# EAGLE design d150_in8-2_rev_a (EAGLE 6.1)
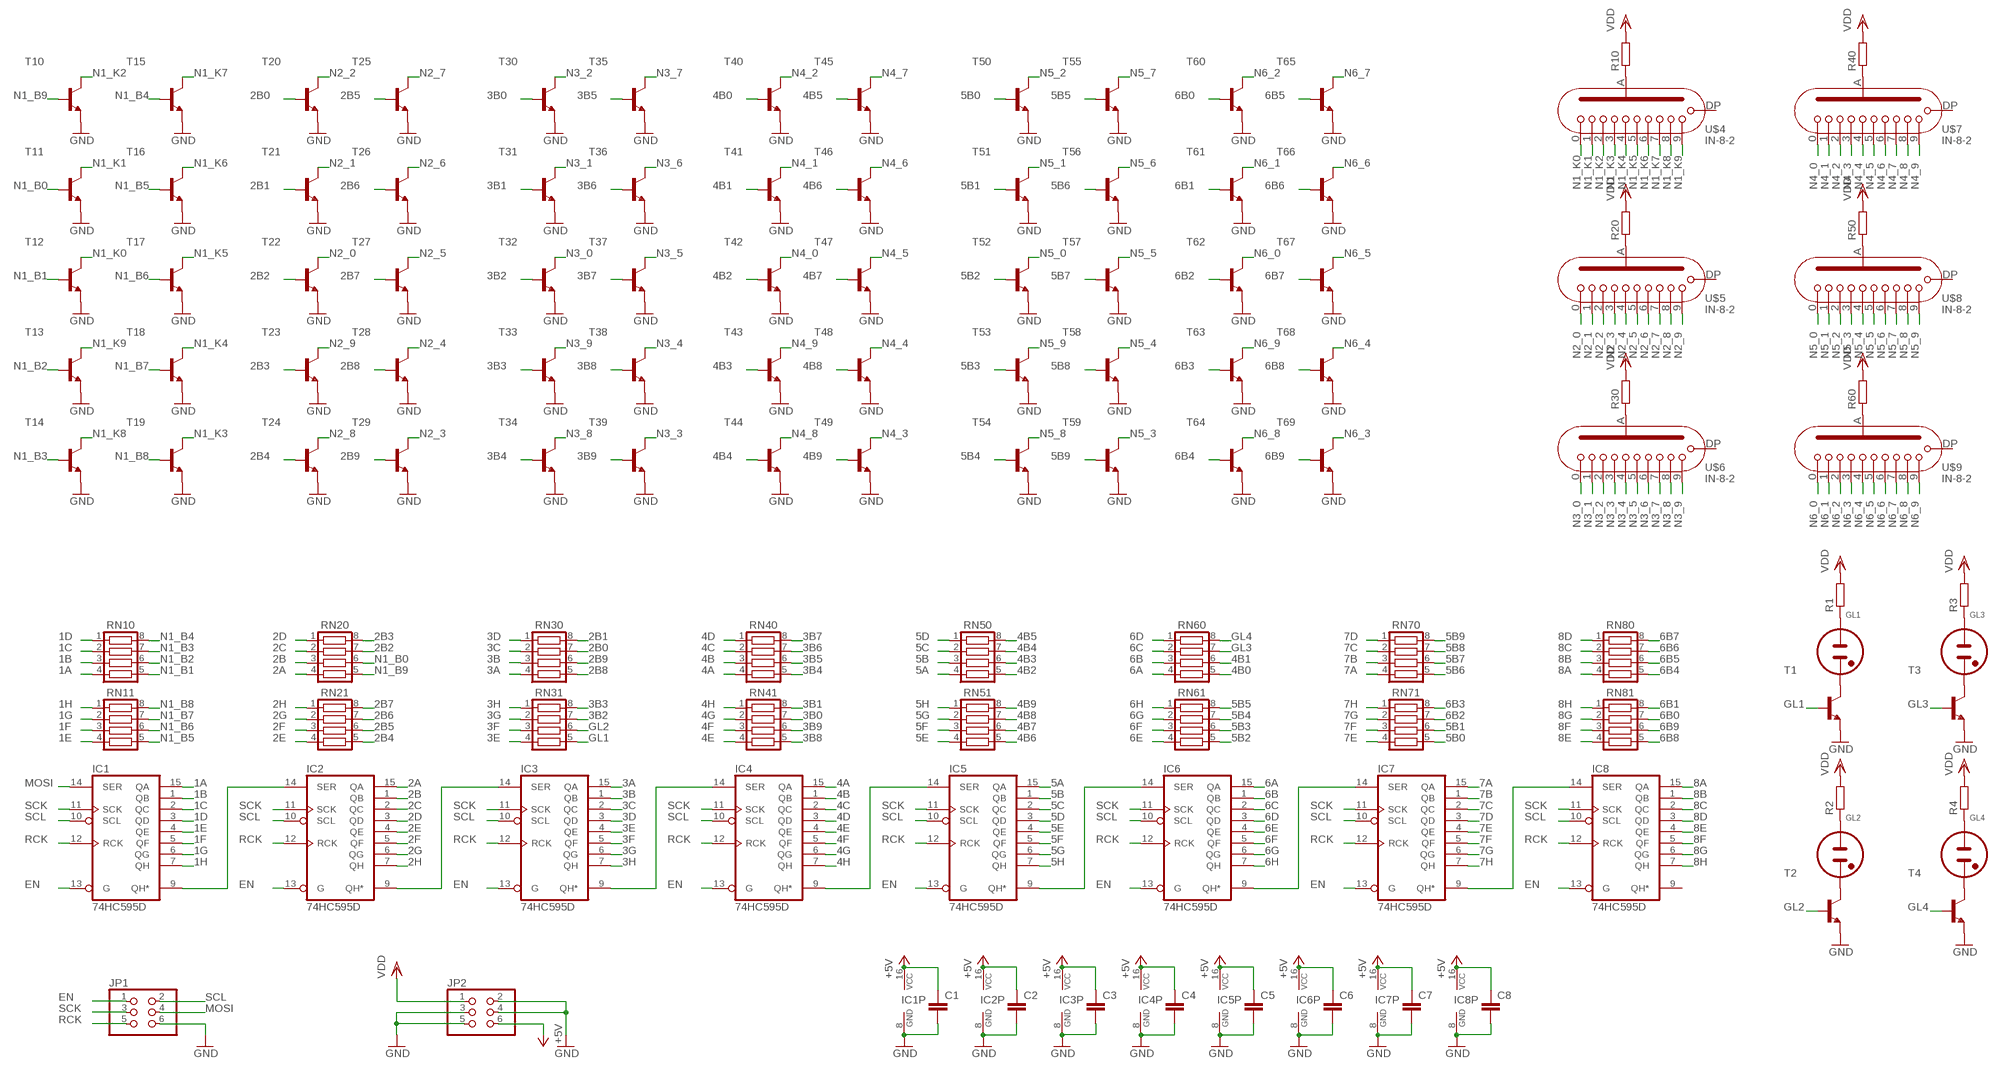
[diagram p0: schematic, sheet 1]

## Parts
C1  C-EUC0603  [C0603]
C2  C-EUC0603  [C0603]
C3  C-EUC0603  [C0603]
C4  C-EUC0603  [C0603]
C5  C-EUC0603  [C0603]
C6  C-EUC0603  [C0603]
C7  C-EUC0603  [C0603]
C8  C-EUC0603  [C0603]
GL1  NE2-NEON-BULB-DRILL  [NE2-NEON-BULB-DRILL]
GL2  NE2-NEON-BULB-DRILL  [NE2-NEON-BULB-DRILL]
GL3  NE2-NEON-BULB-DRILL  [NE2-NEON-BULB-DRILL]
GL4  NE2-NEON-BULB-DRILL  [NE2-NEON-BULB-DRILL]
IC1  74HC595D  [SO16]
IC2  74HC595D  [SO16]
IC3  74HC595D  [SO16]
IC4  74HC595D  [SO16]
IC5  74HC595D  [SO16]
IC6  74HC595D  [SO16]
IC7  74HC595D  [SO16]
IC8  74HC595D  [SO16]
JP1  PINHD-2X3_2.54-SMD  [2X03SMD]
JP2  PINHD-2X3_2.54-SMD  [2X03SMD]
R1  R-EU_R0603  [R0603]
R2  R-EU_R0603  [R0603]
R3  R-EU_R0603  [R0603]
R4  R-EU_R0603  [R0603]
R10  R-EU_R0603  [R0603]
R20  R-EU_R0603  [R0603]
R30  R-EU_R0603  [R0603]
R40  R-EU_R0603  [R0603]
R50  R-EU_R0603  [R0603]
R60  R-EU_R0603  [R0603]
RN10  CTS742C083  [CTS742C083]
RN11  CTS742C083  [CTS742C083]
RN20  CTS742C083  [CTS742C083]
RN21  CTS742C083  [CTS742C083]
RN30  CTS742C083  [CTS742C083]
RN31  CTS742C083  [CTS742C083]
RN40  CTS742C083  [CTS742C083]
RN41  CTS742C083  [CTS742C083]
RN50  CTS742C083  [CTS742C083]
RN51  CTS742C083  [CTS742C083]
RN60  CTS742C083  [CTS742C083]
RN61  CTS742C083  [CTS742C083]
RN70  CTS742C083  [CTS742C083]
RN71  CTS742C083  [CTS742C083]
RN80  CTS742C083  [CTS742C083]
RN81  CTS742C083  [CTS742C083]
T1  SMBTA42  [SOT23]
T2  SMBTA42  [SOT23]
T3  SMBTA42  [SOT23]
T4  SMBTA42  [SOT23]
T10  SMBTA42  [SOT23]
T11  SMBTA42  [SOT23]
T12  SMBTA42  [SOT23]
T13  SMBTA42  [SOT23]
T14  SMBTA42  [SOT23]
T15  SMBTA42  [SOT23]
T16  SMBTA42  [SOT23]
T17  SMBTA42  [SOT23]
T18  SMBTA42  [SOT23]
T19  SMBTA42  [SOT23]
T20  SMBTA42  [SOT23]
T21  SMBTA42  [SOT23]
T22  SMBTA42  [SOT23]
T23  SMBTA42  [SOT23]
T24  SMBTA42  [SOT23]
T25  SMBTA42  [SOT23]
T26  SMBTA42  [SOT23]
T27  SMBTA42  [SOT23]
T28  SMBTA42  [SOT23]
T29  SMBTA42  [SOT23]
T30  SMBTA42  [SOT23]
T31  SMBTA42  [SOT23]
T32  SMBTA42  [SOT23]
T33  SMBTA42  [SOT23]
T34  SMBTA42  [SOT23]
T35  SMBTA42  [SOT23]
T36  SMBTA42  [SOT23]
T37  SMBTA42  [SOT23]
T38  SMBTA42  [SOT23]
T39  SMBTA42  [SOT23]
T40  SMBTA42  [SOT23]
T41  SMBTA42  [SOT23]
T42  SMBTA42  [SOT23]
T43  SMBTA42  [SOT23]
T44  SMBTA42  [SOT23]
T45  SMBTA42  [SOT23]
T46  SMBTA42  [SOT23]
T47  SMBTA42  [SOT23]
T48  SMBTA42  [SOT23]
T49  SMBTA42  [SOT23]
T50  SMBTA42  [SOT23]
T51  SMBTA42  [SOT23]
T52  SMBTA42  [SOT23]
T53  SMBTA42  [SOT23]
T54  SMBTA42  [SOT23]
T55  SMBTA42  [SOT23]
T56  SMBTA42  [SOT23]
T57  SMBTA42  [SOT23]
T58  SMBTA42  [SOT23]
T59  SMBTA42  [SOT23]
T60  SMBTA42  [SOT23]
T61  SMBTA42  [SOT23]
T62  SMBTA42  [SOT23]
T63  SMBTA42  [SOT23]
T64  SMBTA42  [SOT23]
T65  SMBTA42  [SOT23]
T66  SMBTA42  [SOT23]
T67  SMBTA42  [SOT23]
T68  SMBTA42  [SOT23]
T69  SMBTA42  [SOT23]
U$4  IN-8-2  [IN-8-2]
U$5  IN-8-2  [IN-8-2]
U$6  IN-8-2  [IN-8-2]
U$7  IN-8-2  [IN-8-2]
U$8  IN-8-2  [IN-8-2]
U$9  IN-8-2  [IN-8-2]

## Nets
1A: IC1.15(QA) RN10.4
1B: IC1.1(QB) RN10.3
1C: IC1.2(QC) RN10.2
1D: IC1.3(QD) RN10.1
1E: IC1.4(QE) RN11.4
1F: IC1.5(QF) RN11.3
1G: IC1.6(QG) RN11.2
1H: IC1.7(QH) RN11.1
2A: IC2.15(QA) RN20.4
2B: IC2.1(QB) RN20.3
2B0: RN30.7 T20.1(B)
2B1: RN30.8 T21.1(B)
2B2: RN20.7 T22.1(B)
2B3: RN20.8 T23.1(B)
2B4: RN21.5 T24.1(B)
2B5: RN21.6 T25.1(B)
2B6: RN21.7 T26.1(B)
2B7: RN21.8 T27.1(B)
2B8: RN30.5 T28.1(B)
2B9: RN30.6 T29.1(B)
2C: IC2.2(QC) RN20.2
2D: IC2.3(QD) RN20.1
2E: IC2.4(QE) RN21.4
2F: IC2.5(QF) RN21.3
2G: IC2.6(QG) RN21.2
2H: IC2.7(QH) RN21.1
3A: IC3.15(QA) RN30.4
3B: IC3.1(QB) RN30.3
3B0: RN41.7 T30.1(B)
3B1: RN41.8 T31.1(B)
3B2: RN31.7 T32.1(B)
3B3: RN31.8 T33.1(B)
3B4: RN40.5 T34.1(B)
3B5: RN40.6 T35.1(B)
3B6: RN40.7 T36.1(B)
3B7: RN40.8 T37.1(B)
3B8: RN41.5 T38.1(B)
3B9: RN41.6 T39.1(B)
3C: IC3.2(QC) RN30.2
3D: IC3.3(QD) RN30.1
3E: IC3.4(QE) RN31.4
3F: IC3.5(QF) RN31.3
3G: IC3.6(QG) RN31.2
3H: IC3.7(QH) RN31.1
4A: IC4.15(QA) RN40.4
4B: IC4.1(QB) RN40.3
4B0: RN60.5 T40.1(B)
4B1: RN60.6 T41.1(B)
4B2: RN50.5 T42.1(B)
4B3: RN50.6 T43.1(B)
4B4: RN50.7 T44.1(B)
4B5: RN50.8 T45.1(B)
4B6: RN51.5 T46.1(B)
4B7: RN51.6 T47.1(B)
4B8: RN51.7 T48.1(B)
4B9: RN51.8 T49.1(B)
4C: IC4.2(QC) RN40.2
4D: IC4.3(QD) RN40.1
4E: IC4.4(QE) RN41.4
4F: IC4.5(QF) RN41.3
4G: IC4.6(QG) RN41.2
4H: IC4.7(QH) RN41.1
5A: IC5.15(QA) RN50.4
5B: IC5.1(QB) RN50.3
5B0: RN71.5 T50.1(B)
5B1: RN71.6 T51.1(B)
5B2: RN61.5 T52.1(B)
5B3: RN61.6 T53.1(B)
5B4: RN61.7 T54.1(B)
5B5: RN61.8 T55.1(B)
5B6: RN70.5 T56.1(B)
5B7: RN70.6 T57.1(B)
5B8: RN70.7 T58.1(B)
5B9: RN70.8 T59.1(B)
5C: IC5.2(QC) RN50.2
5D: IC5.3(QD) RN50.1
5E: IC5.4(QE) RN51.4
5F: IC5.5(QF) RN51.3
5G: IC5.6(QG) RN51.2
5H: IC5.7(QH) RN51.1
6A: IC6.15(QA) RN60.4
6B: IC6.1(QB) RN60.3
6B0: RN81.7 T60.1(B)
6B1: RN81.8 T61.1(B)
6B2: RN71.7 T62.1(B)
6B3: RN71.8 T63.1(B)
6B4: RN80.5 T64.1(B)
6B5: RN80.6 T65.1(B)
6B6: RN80.7 T66.1(B)
6B7: RN80.8 T67.1(B)
6B8: RN81.5 T68.1(B)
6B9: RN81.6 T69.1(B)
6C: IC6.2(QC) RN60.2
6D: IC6.3(QD) RN60.1
6E: IC6.4(QE) RN61.4
6F: IC6.5(QF) RN61.3
6G: IC6.6(QG) RN61.2
6H: IC6.7(QH) RN61.1
7A: IC7.15(QA) RN70.4
7B: IC7.1(QB) RN70.3
7C: IC7.2(QC) RN70.2
7D: IC7.3(QD) RN70.1
7E: IC7.4(QE) RN71.4
7F: IC7.5(QF) RN71.3
7G: IC7.6(QG) RN71.2
7H: IC7.7(QH) RN71.1
8A: IC8.15(QA) RN80.4
8B: IC8.1(QB) RN80.3
8C: IC8.2(QC) RN80.2
8D: IC8.3(QD) RN80.1
8E: IC8.4(QE) RN81.4
8F: IC8.5(QF) RN81.3
8G: IC8.6(QG) RN81.2
8H: IC8.7(QH) RN81.1
+5V: C1.1 C2.1 C3.1 C4.1 C5.1 C6.1 C7.1 C8.1 IC1.16(VCC) IC2.16(VCC) IC3.16(VCC) IC4.16(VCC) IC5.16(VCC) IC6.16(VCC) IC7.16(VCC) IC8.16(VCC) JP2.6
EN: IC1.13(G) IC2.13(G) IC3.13(G) IC4.13(G) IC5.13(G) IC6.13(G) IC7.13(G) IC8.13(G) JP1.1
GL1: RN31.5 T1.1(B)
GL2: RN31.6 T2.1(B)
GL3: RN60.7 T3.1(B)
GL4: RN60.8 T4.1(B)
GND: C1.2 C2.2 C3.2 C4.2 C5.2 C6.2 C7.2 C8.2 IC1.8(GND) IC2.8(GND) IC3.8(GND) IC4.8(GND) IC5.8(GND) IC6.8(GND) IC7.8(GND) IC8.8(GND) JP1.6 JP2.2 JP2.3 JP2.4 JP2.5 T1.2(E) T2.2(E) T3.2(E) T4.2(E) T10.2(E) T11.2(E) T12.2(E) T13.2(E) T14.2(E) T15.2(E) T16.2(E) T17.2(E) T18.2(E) T19.2(E) T20.2(E) T21.2(E) T22.2(E) T23.2(E) T24.2(E) T25.2(E) T26.2(E) T27.2(E) T28.2(E) T29.2(E) T30.2(E) T31.2(E) T32.2(E) T33.2(E) T34.2(E) T35.2(E) T36.2(E) T37.2(E) T38.2(E) T39.2(E) T40.2(E) T41.2(E) T42.2(E) T43.2(E) T44.2(E) T45.2(E) T46.2(E) T47.2(E) T48.2(E) T49.2(E) T50.2(E) T51.2(E) T52.2(E) T53.2(E) T54.2(E) T55.2(E) T56.2(E) T57.2(E) T58.2(E) T59.2(E) T60.2(E) T61.2(E) T62.2(E) T63.2(E) T64.2(E) T65.2(E) T66.2(E) T67.2(E) T68.2(E) T69.2(E)
MOSI: IC1.14(SER) JP1.4
N1_B0: RN20.6 T11.1(B)
N1_B1: RN10.5 T12.1(B)
N1_B2: RN10.6 T13.1(B)
N1_B3: RN10.7 T14.1(B)
N1_B4: RN10.8 T15.1(B)
N1_B5: RN11.5 T16.1(B)
N1_B6: RN11.6 T17.1(B)
N1_B7: RN11.7 T18.1(B)
N1_B8: RN11.8 T19.1(B)
N1_B9: RN20.5 T10.1(B)
N1_K0: T12.3(C) U$4.0
N1_K1: T11.3(C) U$4.1
N1_K2: T10.3(C) U$4.2
N1_K3: T19.3(C) U$4.3
N1_K4: T18.3(C) U$4.4
N1_K5: T17.3(C) U$4.5
N1_K6: T16.3(C) U$4.6
N1_K7: T15.3(C) U$4.7
N1_K8: T14.3(C) U$4.8
N1_K9: T13.3(C) U$4.9
N2_0: T22.3(C) U$5.0
N2_1: T21.3(C) U$5.1
N2_2: T20.3(C) U$5.2
N2_3: T29.3(C) U$5.3
N2_4: T28.3(C) U$5.4
N2_5: T27.3(C) U$5.5
N2_6: T26.3(C) U$5.6
N2_7: T25.3(C) U$5.7
N2_8: T24.3(C) U$5.8
N2_9: T23.3(C) U$5.9
N3_0: T32.3(C) U$6.0
N3_1: T31.3(C) U$6.1
N3_2: T30.3(C) U$6.2
N3_3: T39.3(C) U$6.3
N3_4: T38.3(C) U$6.4
N3_5: T37.3(C) U$6.5
N3_6: T36.3(C) U$6.6
N3_7: T35.3(C) U$6.7
N3_8: T34.3(C) U$6.8
N3_9: T33.3(C) U$6.9
N4_0: T42.3(C) U$7.0
N4_1: T41.3(C) U$7.1
N4_2: T40.3(C) U$7.2
N4_3: T49.3(C) U$7.3
N4_4: T48.3(C) U$7.4
N4_5: T47.3(C) U$7.5
N4_6: T46.3(C) U$7.6
N4_7: T45.3(C) U$7.7
N4_8: T44.3(C) U$7.8
N4_9: T43.3(C) U$7.9
N5_0: T52.3(C) U$8.0
N5_1: T51.3(C) U$8.1
N5_2: T50.3(C) U$8.2
N5_3: T59.3(C) U$8.3
N5_4: T58.3(C) U$8.4
N5_5: T57.3(C) U$8.5
N5_6: T56.3(C) U$8.6
N5_7: T55.3(C) U$8.7
N5_8: T54.3(C) U$8.8
N5_9: T53.3(C) U$8.9
N6_0: T62.3(C) U$9.0
N6_1: T61.3(C) U$9.1
N6_2: T60.3(C) U$9.2
N6_3: T69.3(C) U$9.3
N6_4: T68.3(C) U$9.4
N6_5: T67.3(C) U$9.5
N6_6: T66.3(C) U$9.6
N6_7: T65.3(C) U$9.7
N6_8: T64.3(C) U$9.8
N6_9: T63.3(C) U$9.9
N$1: GL2.1(A) R2.1
N$2: GL3.1(A) R3.1
N$3: GL4.1(A) R4.1
N$4: R10.1 U$4.A(A1)
N$5: GL2.2(A1) T2.3(C)
N$6: GL1.2(A1) T1.3(C)
N$7: GL4.2(A1) T4.3(C)
N$8: GL3.2(A1) T3.3(C)
N$9: R20.1 U$5.A(A1)
N$10: IC1.9(QH*) IC2.14(SER)
N$11: IC2.9(QH*) IC3.14(SER)
N$12: IC3.9(QH*) IC4.14(SER)
N$13: R30.1 U$6.A(A1)
N$14: R40.1 U$7.A(A1)
N$15: R50.1 U$8.A(A1)
N$16: IC4.9(QH*) IC5.14(SER)
N$17: R60.1 U$9.A(A1)
N$18: IC5.9(QH*) IC6.14(SER)
N$19: IC6.9(QH*) IC7.14(SER)
N$20: IC7.9(QH*) IC8.14(SER)
N$21: GL1.1(A) R1.1
RCK: IC1.12(RCK) IC2.12(RCK) IC3.12(RCK) IC4.12(RCK) IC5.12(RCK) IC6.12(RCK) IC7.12(RCK) IC8.12(RCK) JP1.5
SCK: IC1.11(SCK) IC2.11(SCK) IC3.11(SCK) IC4.11(SCK) IC5.11(SCK) IC6.11(SCK) IC7.11(SCK) IC8.11(SCK) JP1.3
SCL: IC1.10(SCL) IC2.10(SCL) IC3.10(SCL) IC4.10(SCL) IC5.10(SCL) IC6.10(SCL) IC7.10(SCL) IC8.10(SCL) JP1.2
VDD: JP2.1 R1.2 R2.2 R3.2 R4.2 R10.2 R20.2 R30.2 R40.2 R50.2 R60.2
Unconnected: IC8.9(QH*) U$4..(DP) U$5..(DP) U$6..(DP) U$7..(DP) U$8..(DP) U$9..(DP)

## Library data of the parts
C1-C8 = rcl:C-EU: CAPACITOR, European symbol
GL1-GL4 = nixie_tube:NE2-NEON-BULB: Neon indicator (wire connection)
IC1-IC8 = 74xx-eu:74*595: 8-bit SHIFT REGISTER, output latch
JP1 JP2 = con-pinhead:PINHD-2X3: PIN HEADER
R1-R4 R10 R20 R30 R40 R50 R60 = rcl:R-EU_: RESISTOR, European symbol
RN10 RN11 RN20 RN21 RN30 RN31 RN40 RN41 RN50 RN51 RN60 RN61 RN70 RN71 RN80 RN81 = resistor-net:CTS742C083: Chip Resistor Array 4 Single Resistor Source: http://www.ctscorp.com/components/Datasheets/CTSChipArrayDs.pdf; OC_FARNELL: unknown; OC_NEWARK: unknown
T1-T4 T10-T69 = transistor-hv:SMBTA42
U$4-U$9 = nixietubes-russian:IN-8-2

## Board
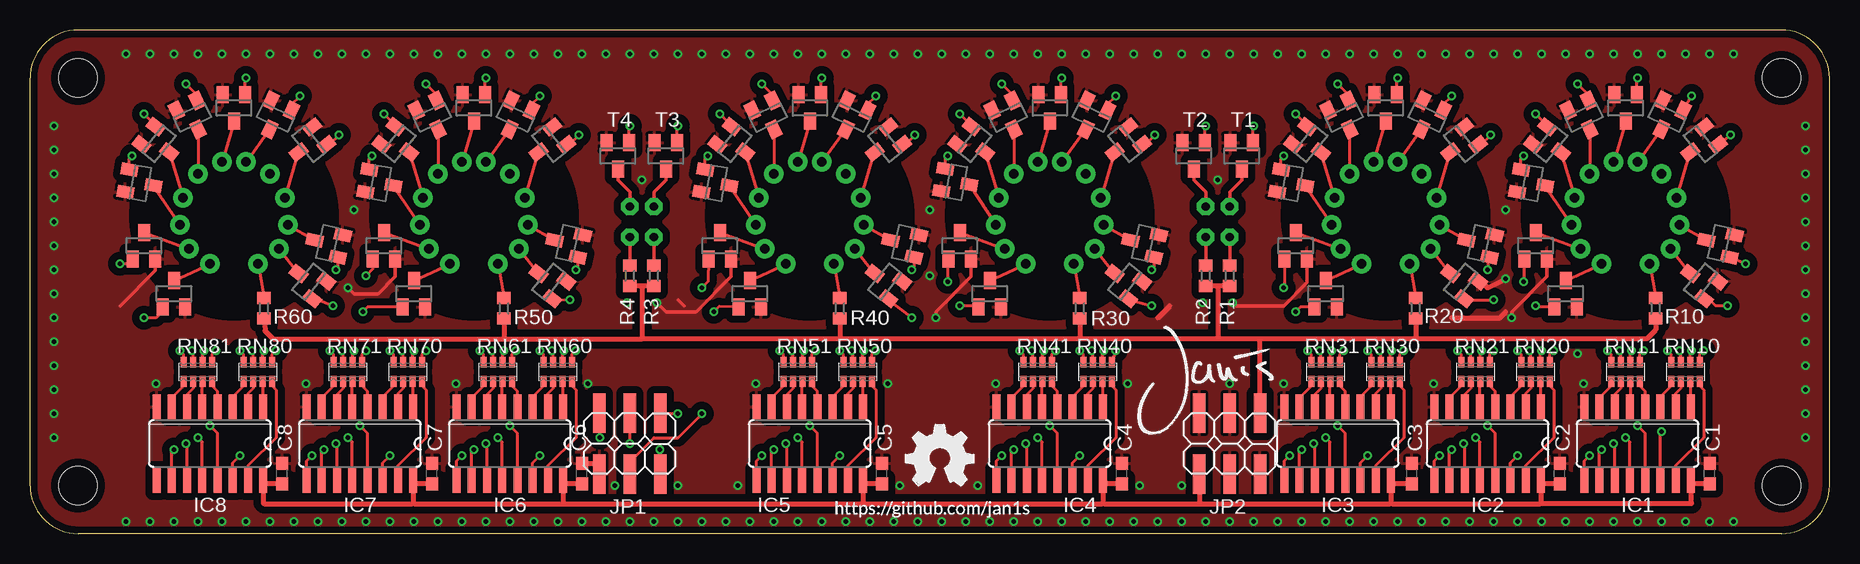
[diagram p1: board, top side]
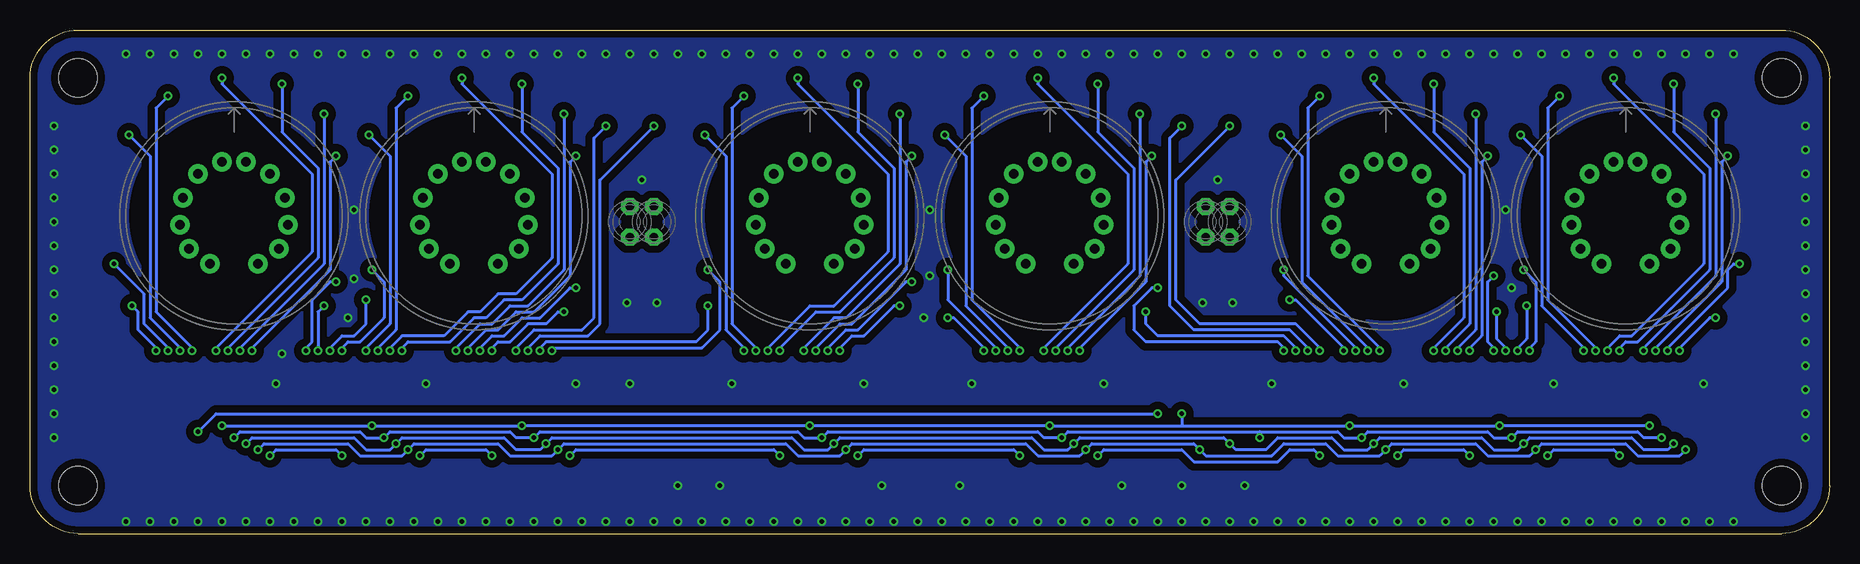
[diagram p2: board, bottom side, seen from below]

Size 150 x 42 mm. Coordinates in mm from the lower left corner, seen from the top.
Outline: 146,0 4,0 arc-90 0,4 0,38 arc-90 4,42 146,42 arc-90 150,38 150,4 arc-90 146,0
Copper layers (1*16): Top 0.035mm / dielectric 1.5mm / Bottom 0.035mm
Design rules: minimum track width 6mil, minimum drill 12mil, track to track 6mil, track to pad 6mil, pad to pad 6mil, via to via 6mil, smd to smd 0mil, copper to edge 10mil, drill to drill 10mil, minimum pad ring 3mil, minimum via ring 6mil, stop-mask expansion 2mil, vias tented up to drill 100mil, thermal gap 10mil
Holes 3.2 mm at 146,4 146,38 4,38 4,4
tRestrict: area 125,18.5 to 141,34.5; area 105,18.5 to 121,34.5; area 77,18.5 to 93,34.5; area 57,18.5 to 73,34.5; area 29,18.5 to 45,34.5; area 9,18.5 to 25,34.5
bRestrict: area 125,18.5 to 141,34.5; area 105,18.5 to 121,34.5; area 77,18.5 to 93,34.5; area 57,18.5 to 73,34.5; area 29,18.5 to 45,34.5; area 9,18.5 to 25,34.5

### Footprints (pad centres in the part's own frame; a part is rotated, then mirrored left to right if it is on the bottom)
C0603 = smd 1.1 x 1: 1 -0.85,0; 2 0.85,0
NE2-NEON-BULB-DRILL = drill 0.7 pad 1.422 octagon: 1 0,1.27; 2 0,-1.27
SO16 = smd 0.66 x 2.032: 1 -4.445,-3.073; 2 -3.175,-3.073; 3 -1.905,-3.073; 4 -0.635,-3.073; 5 0.635,-3.073; 6 1.905,-3.073; 7 3.175,-3.073; 8 4.445,-3.073; 9 4.445,3.073; 10 3.175,3.073; 11 1.905,3.073; 12 0.635,3.073; 13 -0.635,3.073; 14 -1.905,3.073; 15 -3.175,3.073; 16 -4.445,3.073
2X03SMD = smd 1.016 x 3.302: 1 -2.54,-2.54; 2 -2.54,2.54; 3 0,-2.54; 4 0,2.54; 5 2.54,-2.54; 6 2.54,2.54
R0603 = smd 1 x 1.1: 1 -0.85,0; 2 0.85,0
CTS742C083 = smd 0.5 x 0.9: 1 -1.2,-0.8; 2 -0.4,-0.8; 3 0.4,-0.8; 4 1.2,-0.8; 5 1.2,0.8; 6 0.4,0.8; 7 -0.4,0.8; 8 -1.2,0.8
SOT23 = smd 1 x 1.4: 1 -0.95,-1.1; 2 0.95,-1.1; 3 0,1.1
IN-8-2 = drill 0.8: 0 -3.75,-2.75; 1 2,-4; 2 3.75,-2.75; 3 4.5,-0.75; 4 4.25,1.5; 5 3,3.5; 6 1,4.5; 7 -1,4.5; 8 -4.25,1.5; 9 -4.5,-0.75; . -3,3.5; A -2,-4

### Placement (x,y rotation side)
C1  140,5 90 top
C2  127.5,5 90 top
C3  115.2,4.99 90 top
C4  91,5 90 top
C5  71,5 90 top
C6  46,5 90 top
C7  33.5,5 90 top
C8  21,5 90 top
GL1  100,26 180 bottom
GL2  98,26 180 bottom
GL3  52,26 180 bottom
GL4  50,26 180 bottom
IC1  134,7.5 180 top
IC2  121.5,7.5 180 top
IC3  109,7.5 180 top
IC4  85,7.5 180 top
IC5  65,7.5 180 top
IC6  40,7.5 180 top
IC7  27.5,7.5 180 top
IC8  15,7.5 180 top
JP1  50,7.5 180 top
JP2  100,7.5 180 top
R1  100,21.5 270 top
R2  98,21.5 270 top
R3  52,21.5 270 top
R4  50,21.5 270 top
R10  135.5,18.78 270 top
R20  115.5,18.78 270 top
R30  87.5,18.78 270 top
R40  67.5,18.78 270 top
R50  39.5,18.78 270 top
R60  19.5,18.78 270 top
RN10  138,13.5 0 top
RN11  133,13.5 0 top
RN20  125.5,13.5 0 top
RN21  120.5,13.5 0 top
RN30  113,13.5 0 top
RN31  108,13.5 0 top
RN40  89,13.5 0 top
RN41  84,13.5 0 top
RN50  69,13.5 0 top
RN51  64,13.5 0 top
RN60  44,13.5 0 top
RN61  39,13.5 0 top
RN70  31.5,13.5 0 top
RN71  26.5,13.5 0 top
RN80  19,13.5 0 top
RN81  14,13.5 0 top
T1  101,31.5 180 top
T2  97,31.5 180 top
T3  53,31.5 180 top
T4  49,31.5 180 top
T10  125.5,24 0 top
T11  128,20 0 top
T12  139.25,21.01 51.4 top
T13  140.8,24.22 77.1 top
T14  139.25,32.49 128.6 top
T15  136.47,34.71 154.2 top
T16  133,35.5 180 top
T17  129.53,34.71 205.7 top
T18  126.75,32.49 231.4 top
T19  125.2,29.22 260 top
T20  105.5,24 0 top
T21  108,20 0 top
T22  119.25,21.01 51.4 top
T23  120.8,24.22 77.1 top
T24  119.25,32.49 128.6 top
T25  116.47,34.71 154.2 top
T26  113,35.5 180 top
T27  109.53,34.71 205.8 top
T28  106.75,32.5 231.4 top
T29  105.2,29.22 260 top
T30  77.5,24 0 top
T31  80,20 0 top
T32  91.26,21.01 51.4 top
T33  92.81,24.22 77.1 top
T34  91.26,32.49 128.6 top
T35  88.48,34.71 154.2 top
T36  85.01,35.5 180 top
T37  81.54,34.71 205.8 top
T38  78.75,32.5 231.4 top
T39  77.22,29.29 260 top
T40  57.5,24 0 top
T41  60,20 0 top
T42  71.26,21.01 51.4 top
T43  72.81,24.22 77.1 top
T44  71.26,32.49 128.6 top
T45  68.48,34.71 154.2 top
T46  65.01,35.5 180 top
T47  61.54,34.71 205.8 top
T48  58.75,32.5 231.4 top
T49  57.21,29.22 260 top
T50  29.5,24 0 top
T51  32,20 0 top
T52  43.26,21.01 51.4 top
T53  44.8,24.22 77.1 top
T54  43.26,32.49 128.6 top
T55  40.47,34.71 154.2 top
T56  37,35.5 180 top
T57  33.53,34.71 205.8 top
T58  30.75,32.5 231.4 top
T59  29.2,29.22 260 top
T60  9.5,24 0 top
T61  12,20 0 top
T62  23.25,21.01 51.4 top
T63  24.8,24.22 77.1 top
T64  23.25,32.49 128.6 top
T65  20.47,34.71 154.2 top
T66  17,35.5 180 top
T67  13.53,34.71 205.8 top
T68  10.74,32.5 231.4 top
T69  9.2,29.22 260 top
U$1  [OSHW_FILLX200_NOTEXT]  73,4 0 top
U$2  [JANIS_10MM]  92,8 0 top
U$3  [GITHUB/JAN1S]  67,1.5 0 top
U$4  133,26.5 0 bottom
U$5  113,26.5 0 bottom
U$6  85,26.5 0 bottom
U$7  65,26.5 0 bottom
U$8  37,26.5 0 bottom
U$9  17,26.5 0 bottom

### Tracks (layer width: path | path; a pad name or v marks a point on that pad's centre or on a via)
1A
  Top 0.254: RN10.4 139.2,12.3 139.5,12 139.5,8 137.18,5.67 IC1.15
1B
  Top 0.254: IC1.1 138.44,12.65 RN10.3
1C
  Top 0.254: RN10.2 137.6,12.1 137.18,11.68 IC1.2
1D
  Top 0.254: RN10.1 136.8,12.3 135.91,11.4 IC1.3
1E
  Top 0.254: RN11.4 134.2,12.3 134.63,11.87 IC1.4
1F
  Top 0.254: RN11.3 133.4,10.61 IC1.5
1G
  Top 0.254: RN11.2 132.6,12.1 132.09,11.6 IC1.6
1H
  Top 0.254: RN11.1 131.8,12.3 130.82,11.32 IC1.7
2A
  Top 0.254: RN20.4 126.7,12.3 127,12 127,8 124.67,5.67 IC2.15
2B
  Top 0.254: IC2.1 125.94,12.65 RN20.3
2B0  (via drill 0.4)
  Top 0.254: RN30.7 112.6,15.15 v112.5,15.25 | T20.1 104.55,20.55 v104.5,20.5
  Bottom 0.254: v112.5,15.25 112.5,15.5 111.5,16.5 110.5,16.5 109,18 107.5,18 105,20.5 v104.5,20.5
2B1  (via drill 0.4)
  Top 0.254: RN30.8 111.8,14.95 v111.5,15.25 | T21.1 105.9,18.9 v105.5,18.5
  Bottom 0.254: v111.5,15.25 111.5,15.5 111,16 110,16 108.5,17.5 107,17.5 106,18.5 v105.5,18.5
2B2  (via drill 0.4)
  Top 0.254: T22.1 119.52,19.48 v122,19.5 | RN20.7 125.1,15.15 v125,15.25
  Bottom 0.254: v125,15.25 125,15.5 124,16.5 123,16.5 122,17.5 v122,19.5
2B3  (via drill 0.4)
  Top 0.254: T23.1 121.55,23.05 121.5,23 v121.5,22 | RN20.8 124.3,14.95 v124,15.25
  Bottom 0.254: v121.5,22 120.5,21 120.5,18 122.5,16 123.5,16 124,15.5 v124,15.25
2B4  (via drill 0.4)
  Top 0.254: T24.1 120.93,32.43 v121.75,33.25 | RN21.5 121.7,14.95 v122,15.25
  Bottom 0.254: v121.75,33.25 120,31.5 120,17.5 122,15.5 v122,15.25
2B5  (via drill 0.4)
  Top 0.254: T25.1 117.81,35.8 v118.5,36.5 | RN21.6 120.9,15.15 v121,15.25
  Bottom 0.254: v118.5,36.5 119.5,35.5 119.5,17 121,15.5 v121,15.25
2B6  (via drill 0.4)
  Top 0.254: T26.1 113.95,37.95 v114,38 | RN21.7 120.1,15.15 v120,15.25
  Bottom 0.254: v114,38 114,37.5 106.5,30 106.5,23 109.5,20 111,20 112.5,18.5 113.5,18.5 115.5,16.5 119,16.5 120,15.5 v120,15.25
2B7  (via drill 0.4)
  Top 0.254: T27.1 109.91,36.59 v109,37.5 | RN21.8 119.3,14.95 v119,15.25
  Bottom 0.254: v109,37.5 109,33.5 106,30.5 106,22.5 109,19.5 110.5,19.5 112,18 113,18 115,16 118.5,16 119,15.5 v119,15.25
2B8  (via drill 0.4)
  Top 0.254: T28.1 106.48,34.02 v105.5,35 | RN30.5 114.2,14.95 v114.5,15.25
  Bottom 0.254: v105.5,35 105.5,22 108.5,19 110,19 111.5,17.5 112.5,17.5 114.5,15.5 v114.5,15.25
2B9  (via drill 0.4)
  Top 0.254: RN30.6 113.4,15.15 v113.5,15.25 | T29.1 104.28,31.22 v104.5,31.5
  Bottom 0.254: v104.5,31.5 105,31 105,21.5 108,18.5 109.5,18.5 111,17 112,17 113.5,15.5 v113.5,15.25
2C
  Top 0.254: RN20.2 125.1,12.1 124.67,11.68 IC2.2
2D
  Top 0.254: RN20.1 124.3,12.3 123.41,11.4 IC2.3
2E
  Top 0.254: RN21.4 121.7,12.3 122.14,11.87 IC2.4
2F
  Top 0.254: IC2.5 120.86,12.66 RN21.3
2G
  Top 0.254: RN21.2 120.1,12.1 119.59,11.6 IC2.6
2H
  Top 0.254: RN21.1 119.3,12.3 118.33,11.32 IC2.7
3A
  Top 0.254: RN30.4 114.2,12.3 114.5,12 114.5,8 112.17,5.67 IC3.15
3B
  Top 0.254: IC3.1 113.44,12.65 RN30.3
3B0  (via drill 0.4)
  Top 0.254: RN41.7 83.6,15.15 v83.5,15.25 | v76.5,21 76.5,22.35 T30.1
  Bottom 0.254: v76.5,21 77,21 81,17 82,17 83.5,15.5 v83.5,15.25
3B1  (via drill 0.4)
  Top 0.254: RN41.8 82.8,14.95 v82.5,15.25 | T31.1 79.05,18.95 79,19 v77.5,19
  Bottom 0.254: v82.5,15.25 82.5,15.5 81.5,16.5 80.5,16.5 78,19 v77.5,19
3B2  (via drill 0.4)
  Top 0.254: T32.1 91.42,19.58 v93.5,19 | RN31.7 107.6,15.15 v107.5,15.25
  Bottom 0.254: v107.5,15.25 107.5,15.5 107,16 94.5,16 93.5,17 v93.5,19
3B3  (via drill 0.4)
  Top 0.254: T33.1 93.67,22.17 v93.5,22 | RN31.8 106.8,14.95 v106.5,15.25
  Bottom 0.254: v93.5,22 92.5,21 92.5,17 94,15.5 106.5,15.5 v106.5,15.25
3B4  (via drill 0.4)
  Top 0.254: T34.1 92.93,32.43 v93.75,33.25 | RN40.5 90.45,14.95 v90.5,15.25
  Bottom 0.254: v93.75,33.25 92,31.5 92,17 90.5,15.5 v90.5,15.25
3B5  (via drill 0.4)
  Top 0.254: T35.1 89.81,35.81 v90.5,36.5 | RN40.6 89.4,15.15 v89.5,15.25
  Bottom 0.254: v90.5,36.5 91.5,35.5 91.5,17.5 89.5,15.5 v89.5,15.25
3B6  (via drill 0.4)
  Top 0.254: T36.1 85.96,37.96 v86,38 | RN40.7 88.6,15.15 v88.5,15.25
  Bottom 0.254: v86,38 86,37.5 78.5,30 78.5,23.5 83,19 85,19 88.5,15.5 v88.5,15.25
3B7  (via drill 0.4)
  Top 0.254: T37.1 81.91,36.59 v81,37.5 | RN40.8 87.8,14.95 v87.5,15.25
  Bottom 0.254: v81,37.5 81,33.5 78,30.5 78,23 82.5,18.5 84.5,18.5 87.5,15.5 v87.5,15.25
3B8  (via drill 0.4)
  Top 0.254: T38.1 78.49,34.01 v77.5,35 | RN41.5 85.2,14.95 v85.5,15.25
  Bottom 0.254: v77.5,35 77.5,22.5 82,18 83,18 85.5,15.5 v85.5,15.25
3B9  (via drill 0.4)
  Top 0.254: RN41.6 84.4,15.15 v84.5,15.25 | T39.1 76.3,31.3 v76.5,31.5
  Bottom 0.254: v76.5,31.5 77,31 77,22 81.5,17.5 82.5,17.5 84.5,15.5 v84.5,15.25
3C
  Top 0.254: RN30.2 112.6,12.1 112.17,11.68 IC3.2
3D
  Top 0.254: RN30.1 111.8,12.3 110.91,11.4 IC3.3
3E
  Top 0.254: RN31.4 109.2,12.3 109.64,11.87 IC3.4
3F
  Top 0.254: IC3.5 108.36,12.66 RN31.3
3G
  Top 0.254: IC3.6 107.09,11.6 107.6,12.1 RN31.2
3H
  Top 0.254: IC3.7 105.83,11.32 106.8,12.3 RN31.1
4A
  Top 0.254: RN40.4 90.2,12.3 90.5,12 90.5,8 88.17,5.67 IC4.15
4B
  Top 0.254: IC4.1 89.44,12.65 RN40.3
4B0  (via drill 0.4)
  Top 0.254: RN60.5 45.2,14.95 v45.5,15.25 | T40.1 56.54,21.04 v56,20.5
  Bottom 0.254: v56,20.5 56.5,20.5 58,19 58,17 57,16 46,16 45.5,15.5 v45.5,15.25
4B1  (via drill 0.4)
  Top 0.254: RN60.6 44.4,15.15 v44.5,15.25 | T41.1 57.45,18.95 v57,18.5
  Bottom 0.254: v44.5,15.25 44.5,15.5 45.5,16.5 56,16.5 57,17.5 v57,18.5
4B2  (via drill 0.4)
  Top 0.254: T42.1 71.42,19.58 v73.5,18 | RN50.5 70.2,14.95 v70.5,15.25
  Bottom 0.254: v73.5,18 73,18 70.5,15.5 v70.5,15.25
4B3  (via drill 0.4)
  Top 0.254: T43.1 73.67,22.17 v73.5,22 | RN50.6 69.4,15.15 v69.5,15.25
  Bottom 0.254: v73.5,22 73.5,19.5 69.5,15.5 v69.5,15.25
4B4  (via drill 0.4)
  Top 0.254: T44.1 72.93,32.43 v73.75,33.25 | RN50.7 68.6,15.15 v68.5,15.25
  Bottom 0.254: v73.75,33.25 72,31.5 72,19 68.5,15.5 v68.5,15.25
4B5  (via drill 0.4)
  Top 0.254: T45.1 69.81,35.81 v70.5,36.5 | RN50.8 67.8,14.95 v67.5,15.25
  Bottom 0.254: v70.5,36.5 71.5,35.5 71.5,19.5 67.5,15.5 v67.5,15.25
4B6  (via drill 0.4)
  Top 0.254: T46.1 65.96,37.96 v66,38 | RN51.5 65.2,14.95 v65.5,15.25
  Bottom 0.254: v66,38 66,37.5 58.5,30 58.5,22.5 65.5,15.5 v65.5,15.25
4B7  (via drill 0.4)
  Top 0.254: T47.1 61.91,36.59 v61,37.5 | RN51.6 64.4,15.15 v64.5,15.25
  Bottom 0.254: v61,37.5 61,33.5 58,30.5 58,22 64.5,15.5 v64.5,15.25
4B8  (via drill 0.4)
  Top 0.254: T48.1 58.49,34.01 v57.5,35 | RN51.7 63.6,15.15 v63.5,15.25
  Bottom 0.254: v57.5,35 57.5,21.5 63.5,15.5 v63.5,15.25
4B9  (via drill 0.4)
  Top 0.254: RN51.8 62.8,14.95 v62.5,15.25 | T49.1 56.29,31.29 v56.5,31.5
  Bottom 0.254: v56.5,31.5 57,31 57,21 62.5,15.5 v62.5,15.25
4C
  Top 0.254: RN40.2 88.6,12.1 88.17,11.68 IC4.2
4D
  Top 0.254: RN40.1 87.8,12.3 86.91,11.4 IC4.3
4E
  Top 0.254: RN41.4 85.2,12.3 85.64,11.87 IC4.4
4F
  Top 0.254: IC4.5 84.36,12.66 RN41.3
4G
  Top 0.254: IC4.6 83.09,11.6 83.6,12.1 RN41.2
4H
  Top 0.254: RN41.1 82.8,12.3 81.83,11.32 IC4.7
5A
  Top 0.254: RN50.4 70.2,12.3 70.5,12 70.5,8 68.17,5.67 IC5.15
5B
  Top 0.254: IC5.1 69.44,12.65 RN50.3
5B0  (via drill 0.4)
  Top 0.254: RN71.5 27.7,14.95 v28,15.25 | T50.1 28.55,22.05 v28,21.5
  Bottom 0.254: v28,15.25 28,15.5 28.5,16 28.5,21 v28,21.5
5B1  (via drill 0.4)
  Top 0.254: RN71.6 26.9,15.15 v27,15.25 | T51.1 28.15,18.9 v27.75,18.5
  Bottom 0.254: v27,15.25 27,15.5 27.75,16.25 v27.75,18.5
5B2  (via drill 0.4)
  Top 0.254: T52.1 43.42,19.58 v45,19.5 | RN61.5 40.2,14.95 v40.5,15.25
  Bottom 0.254: v45,19.5 44.5,19.5 40.5,15.5 v40.5,15.25
5B3  (via drill 0.4)
  Top 0.254: T53.1 45.66,22.16 v45.5,22 | RN61.6 39.4,15.15 v39.5,15.25
  Bottom 0.254: v39.5,15.25 39.5,15.5 45.5,21.5 v45.5,22
5B4  (via drill 0.4)
  Top 0.254: T54.1 44.93,32.43 v45.75,33.25 | RN61.7 38.6,15.15 v38.5,15.25
  Bottom 0.254: v45.75,33.25 44,31.5 44,21 38.5,15.5 v38.5,15.25
5B5  (via drill 0.4)
  Top 0.254: T55.1 41.8,35.8 v42.5,36.5 | RN61.8 37.8,14.95 v37.5,15.25
  Bottom 0.254: v42.5,36.5 43.5,35.5 43.5,21.5 37.5,15.5 v37.5,15.25
5B6  (via drill 0.4)
  Top 0.254: T56.1 37.95,37.95 v38,38 | RN70.5 32.7,14.95 v33,15.25
  Bottom 0.254: v38,38 38,37.5 30.5,30 30.5,18 33,15.5 v33,15.25
5B7  (via drill 0.4)
  Top 0.254: T57.1 33.91,36.59 v33,37.5 | RN70.6 31.9,15.15 v32,15.25
  Bottom 0.254: v33,37.5 33,33.5 30,30.5 30,17.5 32,15.5 v32,15.25
5B8  (via drill 0.4)
  Top 0.254: T58.1 30.48,34.02 v29.5,35 | RN70.7 31.1,15.15 v31,15.25
  Bottom 0.254: v29.5,35 29.5,17 31,15.5 v31,15.25
5B9  (via drill 0.4)
  Top 0.254: RN70.8 30.3,14.95 v30,15.25 | T59.1 28.28,31.28 v28.5,31.5
  Bottom 0.254: v28.5,31.5 29,31 29,16.5 30,15.5 v30,15.25
5C
  Top 0.254: IC5.2 68.17,11.68 68.6,12.1 RN50.2
5D
  Top 0.254: RN50.1 67.8,12.3 66.91,11.4 IC5.3
5E
  Top 0.254: RN51.4 65.2,12.3 65.64,11.87 IC5.4
5F
  Top 0.254: IC5.5 64.36,12.66 RN51.3
5G
  Top 0.254: IC5.6 63.09,11.6 63.6,12.1 RN51.2
5H
  Top 0.254: RN51.1 62.8,12.3 61.83,11.32 IC5.7
6A
  Top 0.254: RN60.4 45.2,12.3 45.5,12 45.5,8 43.17,5.67 IC6.15
6B
  Top 0.254: IC6.1 44.45,12.65 RN60.3
6B0  (via drill 0.4)
  Top 0.254: RN81.7 13.6,15.15 v13.5,15.25 | T60.1 8.4,22.9 8,22.5 v7.5,22.5
  Bottom 0.254: v13.5,15.25 13.5,15.5 8.5,20.5 8.5,22 8,22.5 v7.5,22.5
6B1  (via drill 0.4)
  Top 0.254: RN81.8 12.8,14.95 v12.5,15.25 | T61.1 11.05,18.55 10.5,18 v9.5,18
  Bottom 0.254: v9.5,18 10,18 12.5,15.5 v12.5,15.25
6B2  (via drill 0.4)
  Top 0.254: T62.1 23.92,19.58 v25.25,19 | RN71.7 26.1,15.15 v26,15.25
  Bottom 0.254: v26,15.25 26,15.5 25.25,16.25 v25.25,19
6B3  (via drill 0.4)
  Top 0.254: T63.1 25.66,22.16 v25.5,22 | RN71.8 25.3,14.95 v25,15.25
  Bottom 0.254: v25.5,22 24.5,21 24.5,16 25,15.5 v25,15.25
6B4  (via drill 0.4)
  Top 0.254: T64.1 24.93,32.43 v25.75,33.25 | RN80.5 20.2,14.95 v20.5,15.25
  Bottom 0.254: v25.75,33.25 24,31.5 24,19 20.5,15.5 v20.5,15.25
6B5  (via drill 0.4)
  Top 0.254: T65.1 21.8,35.8 v22.5,36.5 | RN80.6 19.4,15.15 v19.5,15.25
  Bottom 0.254: v22.5,36.5 23.5,35.5 23.5,19.5 19.5,15.5 v19.5,15.25
6B6  (via drill 0.4)
  Top 0.254: T66.1 17.95,37.95 v18,38 | RN80.7 18.6,15.15 v18.5,15.25
  Bottom 0.254: v18,38 18,37.5 10.5,30 10.5,22.5 16.5,16.5 17.5,16.5 18.5,15.5 v18.5,15.25
6B7  (via drill 0.4)
  Top 0.254: T67.1 13.91,36.59 v13,37.5 | RN80.8 17.8,14.95 v17.5,15.25
  Bottom 0.254: v13,37.5 13,33.5 10,30.5 10,22 16,16 17,16 17.5,15.5 v17.5,15.25
6B8  (via drill 0.4)
  Top 0.254: T68.1 10.48,34.02 v9.5,35 | RN81.5 15.2,14.95 v15.5,15.25
  Bottom 0.254: v9.5,35 9.5,21.5 15.5,15.5 v15.5,15.25
6B9  (via drill 0.4)
  Top 0.254: RN81.6 14.4,15.15 v14.5,15.25 | T69.1 8.28,31.28 v8.5,31.5
  Bottom 0.254: v8.5,31.5 9,31 9,21 14.5,15.5 v14.5,15.25
6C
  Top 0.254: IC6.2 43.17,11.68 43.6,12.1 RN60.2
6D
  Top 0.254: IC6.3 41.91,11.4 42.8,12.3 RN60.1
6E
  Top 0.254: IC6.4 40.63,11.87 40.2,12.3 RN61.4
6F
  Top 0.254: IC6.5 39.37,12.66 RN61.3
6G
  Top 0.254: IC6.6 38.09,11.6 38.6,12.1 RN61.2
6H
  Top 0.254: IC6.7 36.83,11.32 37.8,12.3 RN61.1
7A
  Top 0.254: RN70.4 32.7,12.3 33,12 33,8 30.68,5.67 IC7.15
7B
  Top 0.254: IC7.1 31.95,12.65 RN70.3
7C
  Top 0.254: IC7.2 30.68,11.68 31.1,12.1 RN70.2
7D
  Top 0.254: IC7.3 29.41,11.4 30.3,12.3 RN70.1
7E
  Top 0.254: IC7.4 28.14,11.87 27.7,12.3 RN71.4
7F
  Top 0.254: IC7.5 26.86,12.66 RN71.3
7G
  Top 0.254: RN71.2 26.1,12.1 25.59,11.6 IC7.6
7H
  Top 0.254: RN71.1 25.3,12.3 24.32,11.32 IC7.7
8A
  Top 0.254: RN80.4 20.2,12.3 20.5,12 20.5,8 18.18,5.67 IC8.15
8B
  Top 0.254: IC8.1 19.45,12.65 RN80.3
8C
  Top 0.254: IC8.2 18.18,11.68 18.6,12.1 RN80.2
8D
  Top 0.254: IC8.3 16.91,11.4 17.8,12.3 RN80.1
8E
  Top 0.254: IC8.4 15.63,11.87 15.2,12.3 RN81.4
8F
  Top 0.254: IC8.5 14.37,12.66 RN81.3
8G
  Top 0.254: IC8.6 13.1,11.6 13.6,12.1 RN81.2
8H
  Top 0.254: IC8.7 11.82,11.32 12.8,12.3 RN81.1
+5V
  Top 0.406: 125.94,2.56 IC2.16 126.22,4.15 C2.1 | 125.94,2.56 126,2.5 138.5,2.5 138.44,2.56 IC1.16 138.72,4.15 C1.1 | 113.44,2.56 IC3.16 113.73,4.14 C3.1 | 113.44,2.56 113.5,2.5 125.89,2.5 125.94,2.56 | 89.44,2.56 IC4.16 89.72,4.15 C4.1 | 89.44,2.56 89.5,2.5 97.5,2.5 | 97.5,2.5 113.39,2.5 113.44,2.56 | JP2.6 97.46,2.54 97.5,2.5 | 69.5,2.5 69.44,2.56 IC5.16 69.72,4.15 C5.1 | 69.5,2.5 89.39,2.5 89.44,2.56 | 44.5,2.5 44.45,2.56 IC6.16 44.72,4.15 C6.1 | 44.5,2.5 69.5,2.5 | 31.95,2.56 IC7.16 32.22,4.15 C7.1 | 31.95,2.56 32,2.5 44.5,2.5 | 31.95,2.56 31.89,2.5 19.5,2.5 19.45,2.56 IC8.16 19.72,4.15 C8.1
EN  (via drill 0.4)
  Top 0.254: IC1.13 134.63,8.37 v134,9 | IC2.13 122.14,8.37 v121.5,9 | IC3.13 109.64,8.37 v109,9 | IC4.13 85.64,8.37 v85,9 | IC5.13 65.64,8.37 v65,9 | IC6.13 40.63,8.37 v40,9 | IC7.13 28.14,8.37 v27.5,9 | IC8.13 15.63,8.37 v15,9 | v54,10 52.58,10 JP1.1 53.96,10.04 v54,10
  Bottom 0.254: v134,9 v121.5,9 v109,9 v85,9 v65,9 54,9 | v54,10 54,9 | 54,9 v40,9 v27.5,9 v15,9
GL1  (via drill 0.4)
  Top 0.254: RN31.5 109.2,14.95 v109.5,15.25 | T1.1 101.95,33.95 v102,34
  Bottom 0.254: v109.5,15.25 109.5,15.5 108,17 104,17 103,18 103,33 v102,34
GL2  (via drill 0.4)
  Top 0.254: RN31.6 108.4,15.15 v108.5,15.25 | T2.1 97.95,33.95 v98,34
  Bottom 0.254: v108.5,15.25 108.5,15.5 107.5,16.5 103.5,16.5 102.5,17.5 102.5,29.5 v98,34
GL3  (via drill 0.4)
  Top 0.254: RN60.7 43.6,15.15 v43.5,15.25 | T3.1 53.95,33.95 v54,34
  Bottom 0.254: v43.5,15.25 43.5,15.5 45,17 53,17 55,19 55,33 v54,34
GL4  (via drill 0.4)
  Top 0.254: RN60.8 42.8,14.95 v42.5,15.25 | T4.1 49.95,33.95 v50,34
  Bottom 0.254: v42.5,15.25 42.5,15.5 44.5,17.5 52.5,17.5 54.5,19.5 54.5,29.5 v50,34
GND  (via drill 0.4)
  Top 0.305: 54.5,19 54,19.5 | T10.2 126.45,21.45 123.5,18.5 v123.5,18 | T20.2 106.45,20.95 104.5,19 100.5,19 v100.25,19.25 | T30.2 78.45,21.45 75.5,18.5 v75.5,18 | T40.2 58.45,21.45 55.5,18.5 53,18.5 v52.25,19.25 | T50.2 30.45,21.45 29,20 27,20 v26.5,20.5 | T60.2 10.45,21.95 7.5,19
  Top 0.406: 94,18 95,19 | 118.5,18 122.5,18 123,18.5 | T22.2 120.93,21.07 121.5,20.5 v123,21.25 | JP1.6 47.46,5.96 | 47.46,5.96 47.5,6 | C6.2 47.35,5.85 47.46,5.96
  other vias: 142,40 140,40 138,40 136,40 134,40 132,40 130,40 128,40 126,40 124,40 122,40 120,40 118,40 116,40 114,40 112,40 110,40 108,40 106,40 104,40 102,40 100,40 98,40 96,40 94,40 92,40 90,40 88,40 86,40 84,40 82,40 80,40 78,40 76,40 74,40 72,40 70,40 68,40 66,40 64,40 62,40 60,40 58,40 56,40 54,40 52,40 50,40 48,40 46,40 44,40 42,40 40,40 38,40 36,40 34,40 32,40 30,40 28,40 26,40 24,40 22,40 20,40 18,40 16,40 14,40 12,40 10,40 8,40 148,34 148,32 148,30 148,28 148,26 148,24 148,20 148,22 148,18 148,16 148,14 148,12 148,10 148,8 2,34 2,32 2,30 2,28 2,26 2,24 2,22 2,20 2,18 2,16 2,14 2,12 2,10 2,8 142,1 140,1 138,1 136,1 134,1 132,1 130,1 128,1 126,1 124,1 122,1 120,1 118,1 116,1 114,1 112,1 110,1 108,1 106,1 104,1 102,1 100,1 98,1 96,1 94,1 92,1 90,1 88,1 86,1 84,1 82,1 80,1 78,1 76,1 74,1 72,1 70,1 68,1 66,1 64,1 62,1 60,1 58,1 56,1 54,1 52,1 50,1 48,1 46,1 44,1 42,1 40,1 38,1 36,1 34,1 32,1 30,1 28,1 26,1 24,1 22,1 20,1 18,1 16,1 14,1 12,1 10,1 8,1 104.5,12.5 117,12.5 80.5,12.5 60.5,12.5 35.5,12.5 23,12.5 10.5,12.5 99,29.5 51,29.5 97.75,19.25 49.75,19.25 100,12.5 96,4 92.5,4 129.5,12.5 79,4 72.5,4 59,4 54,4 48.75,4 75,21.5 75,27 123,27 27,27 129,15 46.5,12.5 71.5,12.5 91.5,12.5
  pour Top (isolate 0.61): 147,0 150,3 150,39 147,42 3,42 0,39 0,3 3,0
  pour Bottom (isolate 0.61): 147,0 150,3 150,39 147,42 3,42 0,39 0,3 3,0
MOSI  (via drill 0.4)
  Top 0.254: IC1.14 135.91,8.4 v136,8.5 | JP1.4 50,6 52,8 54,8 v56,10
  Bottom 0.254: v136,8.5 134.5,10 v56,10
N1_B0  (via drill 0.4)
  Top 0.254: RN20.6 125.9,15.15 v126,15.25 | T11.1 125.5,18.9 v125.5,19
  Bottom 0.254: v125.5,19 126,18.5 v126,15.25
N1_B1  (via drill 0.4)
  Top 0.254: RN10.5 139.2,14.95 v139.5,15.25 | v141.5,19 140.5,19 139.92,19.58 T12.1
  Bottom 0.254: v139.5,15.25 139.5,15.5 141,17 141,18.5 v141.5,19
N1_B2  (via drill 0.4)
  Top 0.254: T13.1 141.83,23.05 v143,22.5 | RN10.6 138.4,15.15 v138.5,15.25
  Bottom 0.254: v138.5,15.25 138.5,15.5 140.5,17.5 140.5,20 v143,22.5
N1_B3  (via drill 0.4)
  Top 0.254: T14.1 140.78,32.43 v141.75,33.25 | RN10.7 137.6,15.15 v137.5,15.25
  Bottom 0.254: v141.75,33.25 140,31.5 140,18 137.5,15.5 v137.5,15.25
N1_B4  (via drill 0.4)
  Top 0.254: T15.1 137.81,35.48 v138.5,36.5 | RN10.8 136.8,14.95 v136.5,15.25
  Bottom 0.254: v138.5,36.5 139.5,35.5 139.5,18.5 136.5,15.5 v136.5,15.25
N1_B5  (via drill 0.4)
  Top 0.254: T16.1 133.95,37.95 v134,38 | RN11.5 134.2,14.95 v134.5,15.25
  Bottom 0.254: v134,38 134,37.5 126.5,30 126.5,23.5 134.5,15.5 v134.5,15.25
N1_B6  (via drill 0.4)
  Top 0.254: T17.1 129.91,36.59 v129,37.5 | RN11.6 133.4,15.15 v133.5,15.25
  Bottom 0.254: v129,37.5 129,33.5 126,30.5 126,23 133.5,15.5 v133.5,15.25
N1_B7  (via drill 0.4)
  Top 0.254: T18.1 126.48,34.02 v125.5,35 | RN11.7 132.6,15.15 v132.5,15.25
  Bottom 0.254: v125.5,35 125.5,22.5 132.5,15.5 v132.5,15.25
N1_B8  (via drill 0.4)
  Top 0.254: RN11.8 131.8,14.95 v131.5,15.25 | T19.1 124.28,31.28 v124.5,31.5
  Bottom 0.254: v124.5,31.5 125,31 125,22 131.5,15.5 v131.5,15.25
N1_B9  (via drill 0.4)
  Top 0.254: RN20.5 126.7,14.95 v127,15.25 | T10.1 124.5,22.9 v124.5,21
  Bottom 0.254: v124.5,21 125,21 126.5,19.5 126.5,16 127,15.5 v127,15.25
N1_K0
  Top 0.254: U$4.0 T12.3
N1_K1
  Top 0.254: T11.3 U$4.1
N1_K2
  Top 0.254: T10.3 U$4.2
N1_K3
  Top 0.254: T19.3 U$4.3
N1_K4
  Top 0.254: T18.3 U$4.4
N1_K5
  Top 0.254: T17.3 U$4.5
N1_K6
  Top 0.254: T16.3 U$4.6
N1_K7
  Top 0.254: U$4.7 T15.3
N1_K8
  Top 0.254: U$4.8 T14.3
N1_K9
  Top 0.254: U$4.9 T13.3
N2_0
  Top 0.254: U$5.0 T22.3
N2_1
  Top 0.254: T21.3 U$5.1
N2_2
  Top 0.254: T20.3 U$5.2
N2_3
  Top 0.254: U$5.3 T29.3
N2_4
  Top 0.254: U$5.4 T28.3
N2_5
  Top 0.254: U$5.5 T27.3
N2_6
  Top 0.254: U$5.6 T26.3
N2_7
  Top 0.254: U$5.7 T25.3
N2_8
  Top 0.254: U$5.8 T24.3
N2_9
  Top 0.254: U$5.9 T23.3
N3_0
  Top 0.254: U$6.0 T32.3
N3_1
  Top 0.254: T31.3 U$6.1
N3_2
  Top 0.254: T30.3 U$6.2
N3_3
  Top 0.254: T39.3 U$6.3
N3_4
  Top 0.254: T38.3 U$6.4
N3_5
  Top 0.254: T37.3 U$6.5
N3_6
  Top 0.254: T36.3 U$6.6
N3_7
  Top 0.254: T35.3 U$6.7
N3_8
  Top 0.254: T34.3 U$6.8
N3_9
  Top 0.254: U$6.9 T33.3
N4_0
  Top 0.254: U$7.0 T42.3
N4_1
  Top 0.254: T41.3 U$7.1
N4_2
  Top 0.254: T40.3 U$7.2
N4_3
  Top 0.254: T49.3 U$7.3
N4_4
  Top 0.254: T48.3 U$7.4
N4_5
  Top 0.254: T47.3 U$7.5
N4_6
  Top 0.254: T46.3 U$7.6
N4_7
  Top 0.254: T45.3 U$7.7
N4_8
  Top 0.254: U$7.8 T44.3
N4_9
  Top 0.254: U$7.9 T43.3
N5_0
  Top 0.254: U$8.0 T52.3
N5_1
  Top 0.254: T51.3 U$8.1
N5_2
  Top 0.254: T50.3 U$8.2
N5_3
  Top 0.254: T59.3 U$8.3
N5_4
  Top 0.254: T58.3 U$8.4
N5_5
  Top 0.254: T57.3 U$8.5
N5_6
  Top 0.254: T56.3 U$8.6
N5_7
  Top 0.254: U$8.7 T55.3
N5_8
  Top 0.254: U$8.8 T54.3
N5_9
  Top 0.254: U$8.9 T53.3
N6_0
  Top 0.254: U$9.0 T62.3
N6_1
  Top 0.254: T61.3 U$9.1
N6_2
  Top 0.254: T60.3 U$9.2
N6_3
  Top 0.254: T69.3 U$9.3
N6_4
  Top 0.254: T68.3 U$9.4
N6_5
  Top 0.254: T67.3 U$9.5
N6_6
  Top 0.254: T66.3 U$9.6
N6_7
  Top 0.254: U$9.7 T65.3
N6_8
  Top 0.254: U$9.8 T64.3
N6_9
  Top 0.254: U$9.9 T63.3
N$1
  Top 0.305: GL2.1 R2.1
N$2
  Top 0.305: GL3.1 R3.1
N$3
  Top 0.305: GL4.1 R4.1
N$4
  Top 0.254: U$4.A R10.1
N$5
  Top 0.305: T2.3 97,29.5 98,28.5 GL2.2
N$6
  Top 0.305: T1.3 101,29.5 100,28.5 GL1.2
N$7
  Top 0.305: T4.3 49,29.5 50,28.5 GL4.2
N$8
  Top 0.305: T3.3 53,29.5 52,28.5 GL3.2
N$9
  Top 0.254: U$5.A R20.1
N$10  (via drill 0.4)
  Top 0.254: IC1.9 129.56,6.05 v130,6.5 | v124,6.5 123.41,5.91 IC2.14
  Bottom 0.254: v130,6.5 129.5,7 124.5,7 v124,6.5
N$11  (via drill 0.4)
  Top 0.254: IC2.9 117.06,6.05 v117.5,6.5 | v111.5,6.5 110.91,5.91 IC3.14
  Bottom 0.254: v117.5,6.5 117,7 112,7 v111.5,6.5
N$12  (via drill 0.4)
  Top 0.254: IC3.9 104.56,6.05 v105,6.5 | v87.5,6.5 86.91,5.91 IC4.14
  Bottom 0.254: v105,6.5 104.5,7 88,7 v87.5,6.5
N$13
  Top 0.254: U$6.A R30.1
N$14
  Top 0.254: U$7.A R40.1
N$15
  Top 0.254: U$8.A R50.1
N$16  (via drill 0.4)
  Top 0.254: IC4.9 80.56,6.05 v81,6.5 | v67.5,6.5 66.91,5.91 IC5.14
  Bottom 0.254: v81,6.5 80.5,7 68,7 v67.5,6.5
N$17
  Top 0.254: U$9.A R60.1
N$18  (via drill 0.4)
  Top 0.254: IC5.9 60.55,6.05 v61,6.5 | v42.5,6.5 41.91,5.91 IC6.14
  Bottom 0.254: v61,6.5 60.5,7 54,7 53,6 46,6 45,7 43,7 v42.5,6.5
N$19  (via drill 0.4)
  Top 0.254: IC6.9 35.55,6.05 v36,6.5 | IC7.14 29.41,5.91 v30,6.5
  Bottom 0.254: v36,6.5 35.5,7 30.5,7 v30,6.5
N$20  (via drill 0.4)
  Top 0.254: IC7.9 23.05,6.05 v23.5,6.5 | v17.5,6.5 16.91,5.91 IC8.14
  Bottom 0.254: v23.5,6.5 23,7 18,7 v17.5,6.5
N$21
  Top 0.305: GL1.1 R1.1
RCK  (via drill 0.4)
  Top 0.254: IC1.12 133.37,7.63 v133,8 | IC2.12 120.86,7.63 v120.5,8 | IC3.12 108.36,7.63 v108,8 | IC4.12 84.36,7.63 v84,8 | IC5.12 64.36,7.63 v64,8 | v47.5,8 47.5,10 JP1.5 | IC6.12 39.37,7.63 v39,8 | IC7.12 26.86,7.63 v26.5,8 | IC8.12 14.37,7.63 v14,8
  Bottom 0.254: v133,8 132.5,8.5 122.5,8.5 122,8 v120.5,8 120,8.5 110,8.5 109.5,8 v108,8 107.5,8.5 86,8.5 85.5,8 v84,8 83.5,8.5 66,8.5 65.5,8 v64,8 63.5,8.5 47.5,8.5 | 47.5,8.5 v47.5,8 | 47.5,8.5 41,8.5 40.5,8 v39,8 38.5,8.5 28.5,8.5 28,8 v26.5,8 26,8.5 16,8.5 15.5,8 v14,8
SCK  (via drill 0.4)
  Top 0.254: IC1.11 132.09,7.41 v132,7.5 | IC2.11 119.59,7.41 v119.5,7.5 | IC3.11 107.09,7.41 v107,7.5 | IC4.11 83.09,7.41 v83,7.5 | IC5.11 63.09,7.41 v63,7.5 | v50,7.5 JP1.3 | IC6.11 38.09,7.41 v38,7.5 | IC7.11 25.59,7.41 v25.5,7.5 | IC8.11 13.1,7.41 v13,7.5
  Bottom 0.254: v132,7.5 131.5,8 123,8 122,7 120,7 v119.5,7.5 119,8 110.5,8 109.5,7 107.5,7 v107,7.5 106.5,8 86.5,8 85.5,7 83.5,7 v83,7.5 82.5,8 66.5,8 65.5,7 63.5,7 v63,7.5 62.5,8 50.5,8 v50,7.5 49.5,7 47,7 46,8 41.5,8 40.5,7 38.5,7 v38,7.5 37.5,8 29,8 28,7 26,7 v25.5,7.5 25,8 16.5,8 15.5,7 13.5,7 v13,7.5
SCL  (via drill 0.4)
  Top 0.254: IC1.10 130.82,6.83 v131,7 | IC2.10 118.33,6.83 v118.5,7 | IC3.10 105.83,6.83 v106,7 | IC4.10 81.83,6.83 v82,7 | IC5.10 61.83,6.83 v62,7 | v52.5,7 52.5,5 JP1.2 | IC6.10 36.83,6.83 v37,7 | IC7.10 24.32,6.83 v24.5,7 | IC8.10 11.82,6.83 v12,7
  Bottom 0.254: v131,7 130.5,7.5 123.5,7.5 122.5,6.5 119,6.5 v118.5,7 118,7.5 111,7.5 110,6.5 106.5,6.5 v106,7 105.5,7.5 87,7.5 86,6.5 82.5,6.5 v82,7 81.5,7.5 67,7.5 66,6.5 62.5,6.5 v62,7 61.5,7.5 53,7.5 v52.5,7 52,6.5 46.5,6.5 45.5,7.5 42,7.5 41,6.5 37.5,6.5 v37,7 36.5,7.5 29.5,7.5 28.5,6.5 25,6.5 v24.5,7 24,7.5 17,7.5 16,6.5 12.5,6.5 v12,7
VDD
  Top 0.406: 115.5,16.25 134.75,16.25 135.5,17 R10.2 | 115.5,16.25 102.5,16.25 | 102.5,16.25 99,16.25 | 99,16.25 87.5,16.25 | 87.5,16.25 67.5,16.25 | 67.5,16.25 51,16.25 | R2.2 R1.2 99.15,20.65 99,20.5 99,16.25 | R4.2 R3.2 51.15,20.65 51,20.5 51,16.25 | JP2.1 102.54,16.21 102.5,16.25 | R60.2 19.59,16.91 20.25,16.25 39.5,16.25 | 39.5,16.25 51,16.25 | R50.2 39.5,16.25 | R40.2 67.5,16.25 | R30.2 87.5,16.25 | R20.2 115.5,16.25